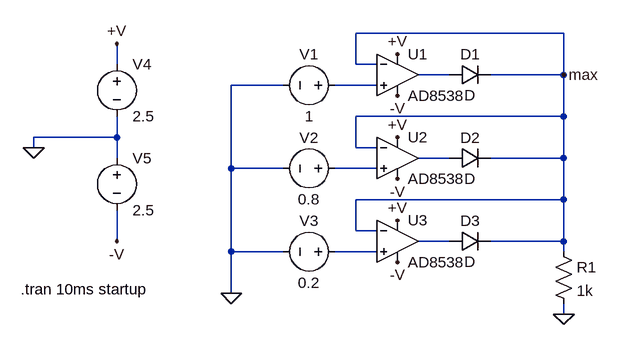
[diagram p0: schematic V3.asc]
V3.asc, the LTspice schematic file:
Version 4
SHEET 1 880 680
WIRE 528 -112 208 -112
WIRE -160 -64 -160 -96
WIRE 208 -64 208 -112
WIRE 240 -64 208 -64
WIRE 352 -48 304 -48
WIRE 528 -48 528 -112
WIRE 528 -48 416 -48
WIRE 96 -32 16 -32
WIRE 240 -32 176 -32
WIRE 528 16 528 -48
WIRE 528 16 208 16
WIRE -160 48 -160 16
WIRE -160 48 -288 48
WIRE -288 64 -288 48
WIRE 208 64 208 16
WIRE 240 64 208 64
WIRE -160 80 -160 48
WIRE 352 80 304 80
WIRE 528 80 528 16
WIRE 528 80 416 80
WIRE 16 96 16 -32
WIRE 96 96 16 96
WIRE 240 96 176 96
WIRE 528 144 528 80
WIRE 528 144 208 144
WIRE 208 192 208 144
WIRE 240 192 208 192
WIRE -160 208 -160 160
WIRE 352 208 304 208
WIRE 528 208 528 144
WIRE 528 208 416 208
WIRE 16 224 16 96
WIRE 96 224 16 224
WIRE 240 224 176 224
WIRE 528 224 528 208
WIRE 16 288 16 224
WIRE 528 320 528 304
FLAG 16 288 0
FLAG 272 -80 +V
FLAG 272 -16 -V
FLAG 528 320 0
FLAG 528 -48 max
FLAG 272 48 +V
FLAG 272 112 -V
FLAG 272 176 +V
FLAG 272 240 -V
FLAG -288 64 0
FLAG -160 -96 +V
FLAG -160 208 -V
SYMBOL voltage 192 -32 R90
WINDOW 0 -32 56 VBottom 2
WINDOW 3 32 56 VTop 2
WINDOW 123 0 0 Left 0
WINDOW 39 0 0 Left 0
SYMATTR InstName V1
SYMATTR Value 1
SYMBOL voltage 192 96 R90
WINDOW 0 -32 56 VBottom 2
WINDOW 3 32 56 VTop 2
WINDOW 123 0 0 Left 0
WINDOW 39 0 0 Left 0
SYMATTR InstName V2
SYMATTR Value 0.8
SYMBOL voltage 192 224 R90
WINDOW 0 -32 56 VBottom 2
WINDOW 3 32 56 VTop 2
WINDOW 123 0 0 Left 0
WINDOW 39 0 0 Left 0
SYMATTR InstName V3
SYMATTR Value 0.2
SYMBOL OpAmps\\AD8538 272 -112 R0
SYMATTR InstName U1
SYMBOL res 512 208 R0
SYMATTR InstName R1
SYMATTR Value 1k
SYMBOL OpAmps\\AD8538 272 16 R0
SYMATTR InstName U2
SYMBOL OpAmps\\AD8538 272 144 R0
SYMATTR InstName U3
SYMBOL voltage -160 -80 R0
WINDOW 123 0 0 Left 0
WINDOW 39 0 0 Left 0
SYMATTR InstName V4
SYMATTR Value 2.5
SYMBOL voltage -160 64 R0
WINDOW 123 0 0 Left 0
WINDOW 39 0 0 Left 0
SYMATTR InstName V5
SYMATTR Value 2.5
SYMBOL diode 352 -32 R270
WINDOW 0 32 32 VTop 2
WINDOW 3 0 32 VBottom 2
SYMATTR InstName D1
SYMBOL diode 352 96 R270
WINDOW 0 32 32 VTop 2
WINDOW 3 0 32 VBottom 2
SYMATTR InstName D2
SYMBOL diode 352 224 R270
WINDOW 0 32 32 VTop 2
WINDOW 3 0 32 VBottom 2
SYMATTR InstName D3
TEXT -308 282 Left 2 !.tran 10ms startup

The netlist it stands for:
* V3.asc
V1 N002 0 1
V2 N004 0 0.8
V3 N006 0 0.2
XU1 N002 max +V -V N001 AD8538  ; pins In+ In- V+ V- OUT
R1 max 0 1k
XU2 N004 max +V -V N003 AD8538  ; pins In+ In- V+ V- OUT
XU3 N006 max +V -V N005 AD8538  ; pins In+ In- V+ V- OUT
V4 +V 0 2.5
V5 0 -V 2.5
D1 N001 max D
D2 N003 max D
D3 N005 max D
.model D D
.lib standard.dio
.tran 10ms startup
.backanno
.end